# EAGLE schematic Adafruit HX711 ADC Breakout (EAGLE 9.6.2)
COMPANY: ADAFRUIT INDUSTRIES; DRAWN: KTOWN; REV: A
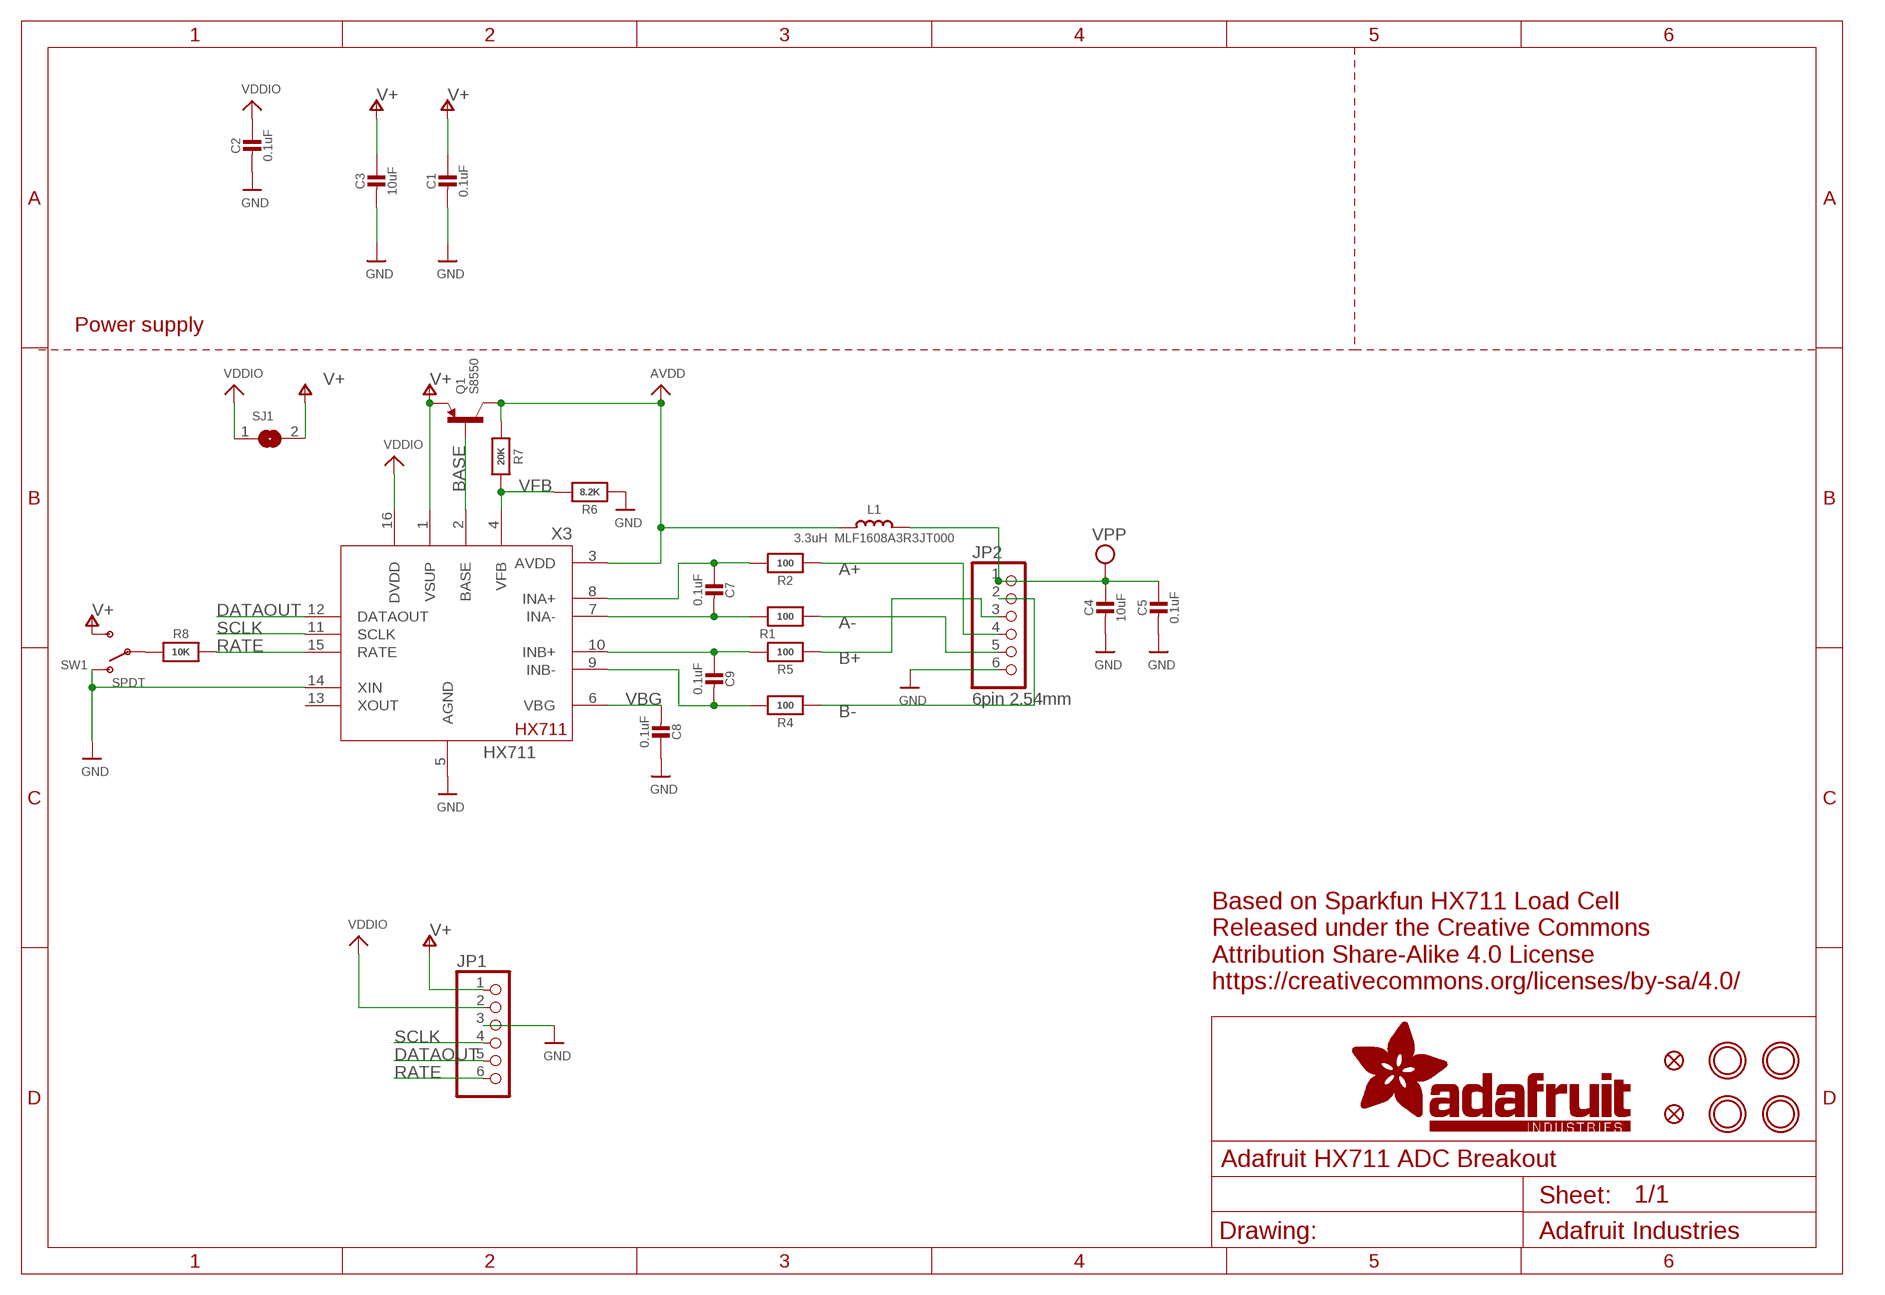
[diagram p0: schematic, sheet 1]

## Parts
C1  0.1uF  CAP_CERAMIC0603_NO  [0603-NO]
C2  0.1uF  CAP_CERAMIC0603_NO  [0603-NO]
C3  10uF  CAP_CERAMIC0805-NOOUTLINE  [0805-NO]
C4  10uF  CAP_CERAMIC0805-NOOUTLINE  [0805-NO]
C5  0.1uF  CAP_CERAMIC0603_NO  [0603-NO]
C7  0.1uF  CAP_CERAMIC0603_NO  [0603-NO]
C8  0.1uF  CAP_CERAMIC0603_NO  [0603-NO]
C9  0.1uF  CAP_CERAMIC0603_NO  [0603-NO]
FID3  FIDUCIAL_0.5MM  [FIDUCIAL_0.5MM]
FID4  FIDUCIAL_0.5MM  [FIDUCIAL_0.5MM]
JP1  HEADER-1X670MIL  [1X06_ROUND_70]
JP2  6pin 2.54mm  HEADER-1X6_2.54MMTERM  [1X06_2.54MMTERMINAL]
L1  3.3uH MLF1608A3R3JT000  INDUCTOR0603_NO  [0603-NO]
Q1  S8550  TRANSISTOR_PNPWIDE  [SOT23-WIDE]
R1  100  RESISTOR_0603_NOOUT  [0603-NO]
R2  100  RESISTOR_0603_NOOUT  [0603-NO]
R4  100  RESISTOR_0603_NOOUT  [0603-NO]
R5  100  RESISTOR_0603_NOOUT  [0603-NO]
R6  8.2K  RESISTOR_0603_NOOUT  [0603-NO]
R7  20K  RESISTOR_0603_NOOUT  [0603-NO]
R8  10K  RESISTOR_0603_NOOUT  [0603-NO]
SJ1  SOLDERJUMPER  [SOLDERJUMPER_ARROW_NOPASTE]
SW1  SPDT  SWITCH_SPDT  [SPDT_SMT_SSSS811101]
U$1  MOUNTINGHOLE2.5  [MOUNTINGHOLE_2.5_PLATED]
U$17  MOUNTINGHOLE2.5  [MOUNTINGHOLE_2.5_PLATED]
U$19  MOUNTINGHOLE2.5  [MOUNTINGHOLE_2.5_PLATED]
U$21  MOUNTINGHOLE2.5  [MOUNTINGHOLE_2.5_PLATED]
X3  HX711  [SO16]

## Nets
A+: JP2.4 R2.2
A-: JP2.5 R1.2
AVDD: L1.1 Q1.3(C) R7.2 X3.3(AVDD)
B+: JP2.3 R5.2
B-: JP2.2 R4.2
BASE: Q1.1(B) X3.2(BASE)
DATAOUT: JP1.5 X3.12(DATAOUT)
GND [highpower]: C1.2 C2.2 C3.2 C4.2 C5.2 C8.1 JP1.3 JP2.6 R6.2 SW1.A(O) X3.5(AGND) X3.14(XIN)
N$2: R8.2 SW1.B(P)
N$5: C7.1 R2.1 X3.8(INA+)
N$6: C7.2 R1.1 X3.7(INA-)
N$10: C9.1 R5.1 X3.10(INB+)
N$11: C9.2 R4.1 X3.9(INB-)
RATE: JP1.6 R8.1 X3.15(RATE)
SCLK: JP1.4 X3.11(SCLK)
V+: C1.1 C3.1 JP1.1 Q1.2(E) SJ1.2 SW1.C(S) X3.1(VSUP)
VBG: C8.2 X3.6(VBG)
VDDIO: C2.1 JP1.2 SJ1.1 X3.16(DVDD)
VFB: R6.1 R7.1 X3.4(VFB)
VPP: C4.1 C5.1 JP2.1 L1.2
Unconnected: X3.13(XOUT)

## Notes on the sheet
- Power supply
- Based on Sparkfun HX711 Load Cell
  Released under the Creative Commons
  Attribution Share-Alike 4.0 License
  https://creativecommons.org/licenses/by-sa/4.0/

## Library data of the parts
C1-C5 C7-C9 = microbuilder:CAP_CERAMIC: Ceramic Capacitors For new designs, use the packages preceded by an '_' character since they are more reliable: The following footprints should be used on most boards: _0402 - Standard footprint for regular board layouts _0603 - Standard footprint for regular board layouts _0805 - Standard footprint for regular board layouts _1206 - Standard footprint for regular board layouts For extremely tight-pitch boards where space is at a premium, the following 'micro-pitch' footprints can be used (smaller pads, no silkscreen outline, etc.): _0402MP - Micro-pitch footprint for very dense/compact boards _0603MP - Micro-pitch footprint for very dense/compact boards _0805MP - Micro-pitch footprint for very dense/compact boards _1206MP - Micro-pitch footprint for very dense/compact boards
FID3 FID4 = microbuilder:FIDUCIAL: Fiducial Alignment Points Various fiducial points for machine vision alignment.
JP1 JP2 = microbuilder:HEADER-1X6: PIN HEADER
L1 = microbuilder:INDUCTOR: Inductors 0603: 10nH Ceramic Inductor - microwire antenna/RF (Digikey: 712-1434-2-ND) 0805: 560nH Ceramic Inductor - RF (Digikey: 553-1047-1-ND) 270nH Ceramic Inductor - Q = 40@250MHz, +-5%, 1 Ohm DC Resistance (Digikey: 535-10506-2-ND) 1007 (2518 Metric) SMT: 10µH 10% 250mOhm 820mA 1007 Inductor (Digikey: 587-2189-1-ND) 22µH 10% 500mOhm 580mA 1007 Inductor (Digikey: 587-2190-1-ND) 47µH 10% 950mOhm 420mA 1007 Inductor (Digikey: 587-2191-1-ND) 47µH 5% 100mOhm 1A 1008 Inductor (Digikey: 732-1816-1-ND) 5.0x5.0mm (Taiyo Yuden NR5040 Series) 6.8µH 20% 2.3A 64mOhm Inductor (Digikey: 587-2374-2-ND) 5.0x5.0mm (TDK VLC5045 Series) 4.7µH 20% 3.3A 34mOhm Inductor (Digikey: 445-6526-1-ND) 6.8µH 20% 2.7A 46mOhm Inductor (Digikey: 445-6527-1-ND) 6.0x6.0mm (TDK VLC6045 Series) 4.7µH 20% 3.8A 27mOhm Inductor (Digikey: 445-6538-2-ND) 6.8µH 20% 3A 41mOhm Inductor (Digikey: 445-6540-1-ND) 6.2µH 30% 2.2A 45mOhm Inductor (Digikey: SRR5028-6R2YCT-ND) - Not TDK VLC6045 but footprint should match 6.0x6.0mm (TDK SLF6045 Series) 6.8uH 30% 2A 33mOhm Inductor (Digikey: 445-4572-1-ND, Mouser: 810-SLF645T6R8N2R0PF) 6.0x6.0mm (Sumida CDRH5D28 Series) 6.2uH 30% 1.8A 45mOhm Inductor (Digikey: 308-1542-1-ND) Taiyo Yuden NR3015T2R2M - 2.2uH 20% 1.5A (Digikey: 587-1648-2-ND, Mouser: 963-NR3015T2R2M) - Used with TI TPS62172 CoilCraft RFID Transponder Coil - MA5532-AE (For use with AS3935 Lightning Sensor) Taiyo Yuden NRH2412T2R2MNGH - 2.2uH 20% 1AA (Digikey: 587-3443-1-ND) - Used with TI LM3671 Vishay IHLP 1.0uH Molded Inductor - 24mOhm DCR, 5A, +/-20%, -55°C-125°C (Digikey: 541-1319-1-ND)
Q1 = microbuilder:TRANSISTOR_PNP: PNP Transistor Transistor (PNP) 800mA 60V, 1.6V VCE @ 500mA [Digikey: MMBT2907AFSTR-ND] Transistor (PNP) Low Sat - 1.5A 20V, 260mV VCE @ 400mA [Digikey: ZXTP25020DFLTR-ND] SOT23-R - SOT23 footprint optimised for use with solder paste and reflow ovens. SOT23-W - SOT23 footprint optimised for hand-soldering (larger pads).
R1 R2 R4-R8 = microbuilder:RESISTOR: Resistors For new designs, use the packages preceded by an '_' character since they are more reliable: The following footprints should be used on most boards: _0402 - Standard footprint for regular board layouts _0603 - Standard footprint for regular board layouts _0805 - Standard footprint for regular board layouts _1206 - Standard footprint for regular board layouts For extremely tight-pitch boards where space is at a premium, the following 'micro-pitch' footprints can be used (smaller pads, no silkscreen outline, etc.): _0402MP - Micro-pitch footprint for very dense/compact boards _0603MP - Micro-pitch footprint for very dense/compact boards _0805MP - Micro-pitch footprint for very dense/compact boards _1206MP - Micro-pitch footprint for very dense/compact boards
SJ1 = microbuilder:SOLDERJUMPER: SMD Solder JUMPER Solder the two pads together to create a connection, or remove the solder to break it. REFLOW - Use this footprint for solder paste and reflow ovens. WAVE - Use this footprint for hand-soldering (larger pads). CLOSED - Has a trace between the two pads to ensure it is closed by default. The trace needs to be cut to disable the jumper, and can be closed again by creating a solder bridge between the two pads.; BOM: EXCLUDE
SW1 = adafruit_electromech:SWITCH_SPDT: Switch - SPDT SSSS811101 - Horizontal Two Position SMT, 0.3A 4V [Mouser: 688-SSSS811101]
U$1 U$17 U$19 U$21 = adafruit_electromech:MOUNTINGHOLE: Mounting Hole For #2 screws (0.086"/2.18mm width, 0.094"/2.4mm hole) use 2.5mm; BOM: EXCLUDE
X3 = adafruit_sensor:HX711

## Net classes
1 highpower: width 0.254 mm, drill 0.483 mm
2 lowpower: width 0.254 mm, drill 0.483 mm